# Altium schematic sheet ESP32_S2.SchDoc
size A2; SheetNumber: 2; SheetTotal: 4
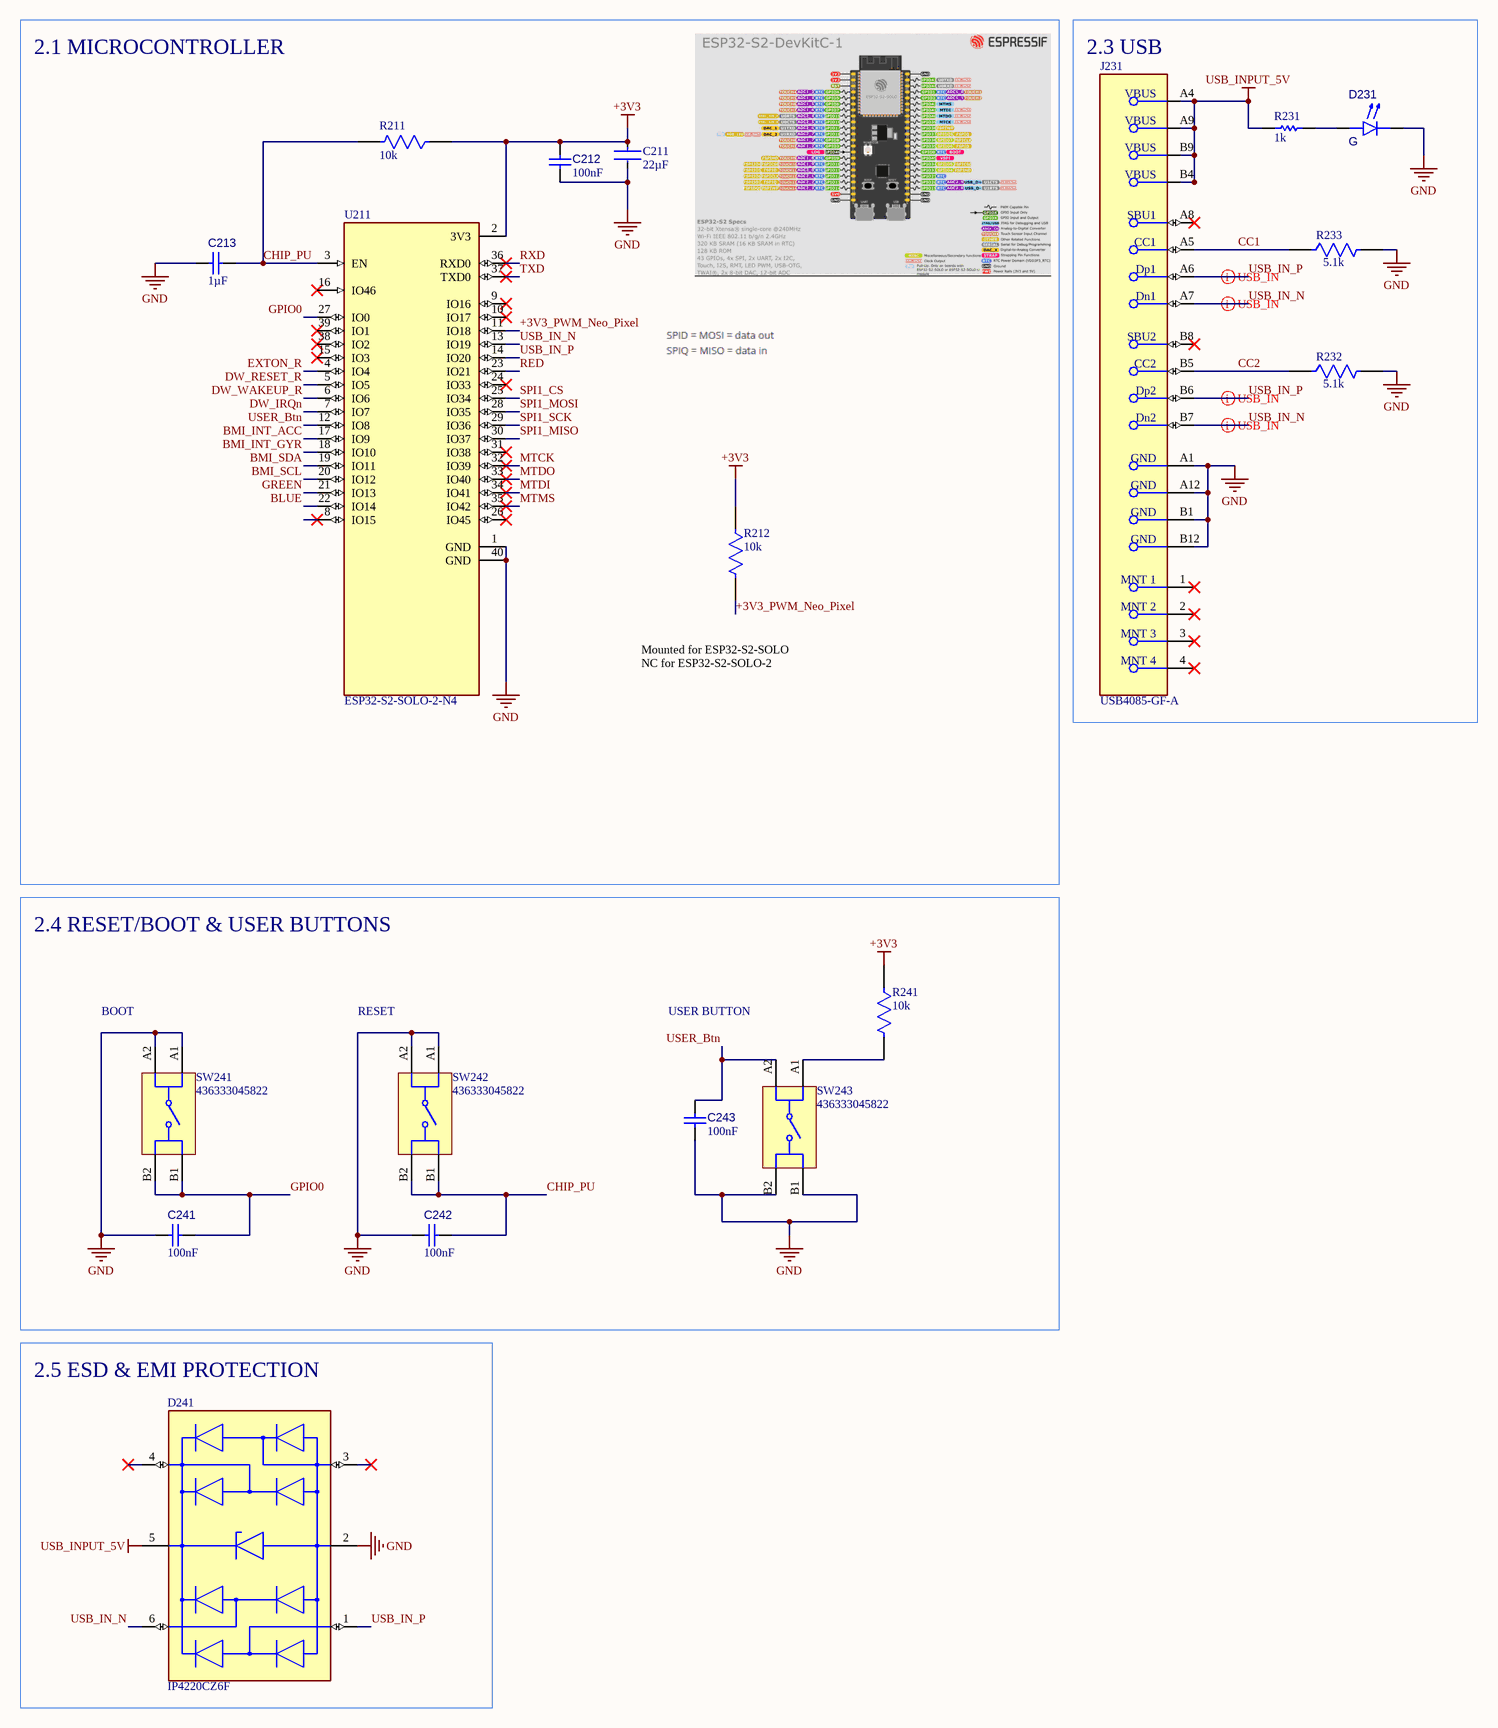
[diagram p0: ESP32_S2.SchDoc]

## Parts
C211  value 22µF  [FP-GRM21B-0_2-e0_2_0_7-MFG]  (hidden comment: GRM21BZ71A226ME15L)
C212  value 100nF  [CAPC0402(1005)60_L]  (hidden comment: Capacitor 100nF +/-20% 10V 0402)
C213  value 1µF  [CAPC0402(1005)60_L]  (hidden comment: Capacitor 1µF +/-20% 10V 0402)
C241  value 100nF  [CAPC1005X56X25LL10T15]  (hidden comment: Capacitor 0.1 uF +/- 5% 16 V 0402)
C242  value 100nF  [CAPC1005X56X25LL10T15]  (hidden comment: Capacitor 0.1 uF +/- 5% 16 V 0402)
C243  value 100nF  [CAPC1005X56X25LL10T15]  (hidden comment: Capacitor 0.1 uF +/- 5% 16 V 0402)
D231  G  [WL-SMCW_0603_150060xx75000]
D241  IP4220CZ6F  [FP-SOT457-IPC_C]
J231  USB4085-GF-A  [FP-USB4085-GF-A-MFG]
R211  value 10k  [FP-RC0402-0_4-MFG]  (hidden comment: RC0402JR-0710KL)
R212  value 10k  [FP-RC0402-0_4-MFG]  (hidden comment: RC0402JR-0710KL)
R231  value 1k  [RESC2013X60X35ML10T20]  (hidden comment: RC0805FR-071KL)
R232  value 5.1k  [FP-RT0402-IPC_B]  (hidden comment: RT0402DRE075K1L)
R233  value 5.1k  [FP-RT0402-IPC_B]  (hidden comment: RT0402DRE075K1L)
R241  value 10k  [FP-RC0402-0_4-MFG]  (hidden comment: RC0402JR-0710KL)
SW241  436333045822  [436333045822]
SW242  436333045822  [436333045822]
SW243  436333045822  [436333045822]
U211  ESP32-S2-SOLO-2-N4  [XCVR_ESP32-S2-SOLO-N4]

## Blocks framed on the sheet
2.1 MICROCONTROLLER: C211-C213 R211 R212 U211
2.3 USB: D231 J231 R231-R233
2.4 RESET/BOOT & USER BUTTONS: C241-C243 R241 SW241-SW243
2.5 ESD & EMI PROTECTION: D241

## Nets
+3V3: C211.1 C212.2 R211.1 R212.1 R241.1 U211.2(3V3)
GND: C211.2 C212.1 C213.2 C241.1 C242.1 C243.1 D231.1(K) D241.2(GND) J231.A1(GND) J231.A12(GND) J231.B1(GND) J231.B12(GND) R232.2 R233.2 SW241.A1 SW241.A2 SW242.A1 SW242.A2 SW243.B1 SW243.B2 U211.1(GND) U211.40(GND)
USB_INPUT_5V: D241.5(VP) J231.A4(VBUS) J231.A9(VBUS) J231.B4(VBUS) J231.B9(VBUS) R231.1
+3V3_PWM_Neo_Pixel: R212.2 U211.11(IO18)
BLUE: U211.22(IO14)
BMI_INT_ACC: U211.17(IO9)
BMI_INT_GYR: U211.18(IO10)
BMI_SCL: U211.20(IO12)
BMI_SDA: U211.19(IO11)
CC1: J231.A5(CC1) R233.1
CC2: J231.B5(CC2) R232.1
CHIP_PU: C213.1 C242.2 R211.2 SW242.B1 SW242.B2 U211.3(EN)
DW_IRQn: U211.7(IO7)
DW_RESET_R: U211.5(IO5)
DW_WAKEUP_R: U211.6(IO6)
EXTON_R: U211.4(IO4)
GPIO0: C241.2 SW241.B1 SW241.B2 U211.27(IO0)
GREEN: U211.21(IO13)
MTCK: U211.32(IO39)
MTDI: U211.34(IO41)
MTDO: U211.33(IO40)
MTMS: U211.35(IO42)
RED: U211.23(IO21)
RXD: U211.36(RXD0)
SPI1_CS: U211.25(IO34)
SPI1_MISO: U211.30(IO37)
SPI1_MOSI: U211.28(IO35)
SPI1_SCK: U211.29(IO36)
TXD: U211.37(TXD0)
USB_IN_N: D241.6(I/O4) J231.A7(Dn1) J231.B7(Dn2) U211.13(IO19)
USB_IN_P: D241.1(I/O1) J231.A6(Dp1) J231.B6(Dp2) U211.14(IO20)
USER_Btn: C243.2 SW243.A2 U211.12(IO8)
NetD231_2: D231.2(A) R231.2
NetR241_2: R241.2 SW243.A1

Not connected (* = marked no-connect by the designer): D241 3(I/O2)* 4(I/O3)*; J231 1(MNT_1)* 2(MNT_2)* 3(MNT_3)* 4(MNT_4)* A8(SBU1)* B8(SBU2)*; U211 8(IO15)* 9(IO16)* 10(IO17)* 15(IO3)* 16(IO46)* 24(IO33)* 26(IO45)* 31(IO38)* 38(IO2)* 39(IO1)*

## Layout directives
differential pair: USB_IN_N, USB_IN_P

## Notes on the sheet
- Mounted for ESP32-S2-SOLO
  NC for ESP32-S2-SOLO-2
- BOOT
- RESET
- USER BUTTON

## Library data of the parts
C211 = CMP-001-00090-1: Ceramic Capacitor, Multilayer, Ceramic, 10V, 20% +Tol, 20% -Tol, X7R, 15% TC, 22uF, Surface Mount, 0805; Min Operating Temperature: -55°C; Mounting Technology: Surface Mount; Case/Package: 0805; Max Operating Temperature: 125°C; Pins: 2; RoHS Compliant: Yes; Capacitor Type: Ceramic
C212 = CMP-001-00061-3: Chip Capacitor, 100nF +/-20%, 10V, 0402, Thickness 0.6 mm; Tolerance: 20%; Mounting Technology: SMT; Voltage Rating: 10V; Max Operating Temperature: 85°C; Pins: 2; Case/Package: 0402; Min Operating Temperature: -55°C
C213 = CMP-001-00063-3: Chip Capacitor, 1µF +/-20%, 10V, 0402, Thickness 0.6 mm; Tolerance: 10%; Mounting Technology: SMT; Max Operating Temperature: 85°C; Voltage Rating: 10V; Pins: 2; Case/Package: 0402; Min Operating Temperature: -55°C
C241-C243 = CMP-001-00001-6: Chip Capacitor, 0.1 uF, +/- 5%, 16 V, 0402 (1005 Metric); Capacitor Type: Ceramic; Voltage Rating: 16V; Max Operating Temperature: 125°C; Min Operating Temperature: -55°C; Case/Package: 0402; Mounting Technology: SM; Pins: 2; Tolerance: 5%; RoHS Compliant: True
D231 = CMP-007-00038-1: Single Color LED, Green, Water Clear, 1.1mm; Max Operating Temperature: 85°C; Min Operating Temperature: -40°C; RoHS Compliant: Yes
D241 = CMP-004-00031-1: Trans Voltage Suppressor Diode, Unidirectional, 1 Element, Silicon; Min Breakdown Voltage: 6V; Max Breakdown Voltage: 9V; Number of Elements: 1; Package Body Material: Plastic; Package Style: SMALL OUTLINEMeter; Package Shape: Rectangular; JESD-30 Code: R-PDSO-G6; Terminal Form: Gull Wing; Pins: 6; Surface Mount: Yes; RoHS Compliant: Yes; Terminal Position: DUAL; Technology: ZENER; Reach SVHC Compliant: Yes; Diode Element Material: SILICON; Diode Type: TRANS VOLTAGE SUPPRESSOR; Polarity: Unidirectional
J231 = CMP-002-00071-1: USB Connector, 16 Contact(s), Female, Right Angle, Solder Terminal, Receptacle
R211 R212 R241 = CMP-009-00196-1: Fixed Resistor, Metal Glaze/thick Film, 0.0625W, 10000ohm, 50V, 5% +/-Tol, 100ppm/Cel, Surface Mount, 0402; Package Width: 0.5mm; Rated Temperature: 70°C; Power: 62.5mW; Package Height: 0.35mm; Temperature Coefficient: 100ppm/°C; Package Length: 1mm; Additional Feature: LASER TRIMMABLE; Reach SVHC Compliant: Yes; Terminal Finish: Nickel; Package Shape: Rectangular; Package Style: SMTMeter; JESD-609 Code: e3; Tolerance: 5%; Technology: METAL GLAZE/THICK FILM; Case/Package: 0402; Working Voltage: 50V; Termination: Wraparound; Min Operating Temperature: -55°C; Resistor Type: FIXED RESISTOR; Max Operating Temperature: 155°C; Construction: Chip; RoHS Compliant: Yes; Packaging: Tape and Reel; Mounting Technology: Surface Mount; Pins: 2
R231 = CMP-009-00207-1: Fixed Resistor, Metal Glaze/thick Film, 0.125W, 1000ohm, 150V, 1% +/-Tol, 100ppm/Cel, Surface Mount, 0805; Temperature Coefficient: 100ppm/°C; Package Height: 0.5mm; Power: 125mW; Rated Temperature: 70°C; Package Width: 1.25mm; Package Length: 2mm; Additional Feature: LASER TRIMMABLE; Technology: METAL GLAZE/THICK FILM; RoHS Compliant: Yes; Construction: Chip; Case/Package: 0805; Resistor Type: FIXED RESISTOR; JESD-609 Code: e3; Packaging: Tape and Reel; Tolerance: 1%; Reach SVHC Compliant: Yes; Max Operating Temperature: 155°C; Terminal Finish: Nickel; Min Operating Temperature: -55°C; Package Style: SMTMeter; Mounting Technology: Surface Mount; Working Voltage: 150V; Pins: 2; Package Shape: Rectangular; Termination: Wraparound
R232 R233 = CMP-009-00198-1: Fixed Resistor, Thin Film, 0.0625W, 5100ohm, 50V, 0.5% +/-Tol, 50ppm/Cel, Surface Mount, 0402; Rated Temperature: 70°C; Power: 62.5mW; Additional Feature: HIGH PRECISION; Package Height: 0.3mm; Temperature Coefficient: 50ppm/°C; Package Length: 1mm; Package Width: 0.5mm; Packaging: Tape and Reel; Construction: Chip; Technology: THIN FILM; Working Voltage: 50V; Min Operating Temperature: -55°C; Pins: 2; Case/Package: 0402; Mounting Technology: Surface Mount; Resistor Type: FIXED RESISTOR; RoHS Compliant: Yes; Termination: Wraparound; Package Style: SMTMeter; Max Operating Temperature: 155°C; Tolerance: 0.5%; Reach SVHC Compliant: Yes
SW241-SW243 = CMP-011-00016-1: Keypad Switch, 1 Switches, SPST, Momentary-tactile, 0.05A, 12VDC, 2.65N, Solder Terminal, Surface Mount-right Angle; Body Color: Black; Body Breadth: 3.5inch; End Contact Material: Stainless Steel; Solderability: REFLOW; Contact Resistance: 0.1mR; Actuator Type: STEM; Contact Function: On-Off; End Contact Plating: Silver; Dielectric Withstand Volts: 250VACV; Actuator Material: Polyamide; Contact DC Max Rating R Load: .05A@12VDC; Electrical Life: 100000Cycles; Contact Voltage(DC)-Max: 12V; Body Length or Diameter: 4.7mm; Actuator Length: 0.039inch; Insulation Resistance: 100MR; Circuit Configuration: 1X1; Number of Switches: 1; Body Height: 1.65mm; Contact Current(DC)-Max: 50mA; Terminal Material: Copper Alloy; Min Operating Temperature: -40°C; Switch Type: Keypad; Switch Action: MOMENTARY-TACTILE; Max Operating Temperature: 85°C; Packaging: Tape and Reel; Switch Function: SPST; Center Contact Plating: Silver; Contact Material: Stainless Steel; Mounting Technology: Surface Mount; Reach SVHC Compliant: Yes; Termination: Solder; RoHS Compliant: Yes; Housing Material: Stainless Steel; Insulation Material: Polyamide; Operating Force-Max: 2.65N
U211 = CMP-009-000000-5: SMD Module, ESP32-S2, 4 mb Spi F; MF: Espressif Systems; Source: ESP32-S2-SOLO-N4.SchLib; Package: None; Pin Count: 49; Design Item ID: ESP32-S2-SOLO-N4; Value: *; Component Type: Standard; MP: ESP32-S2-SOLO-N4; Check_prices: https://www.snapeda.com/parts/ESP32-S2-SOLO-N4/Espressif+Systems/view-part/?ref=eda; SnapEDA_Link: https://www.snapeda.com/parts/ESP32-S2-SOLO-N4/Espressif+Systems/view-part/?ref=snap